# EAGLE schematic function_generator (EAGLE 6.1)
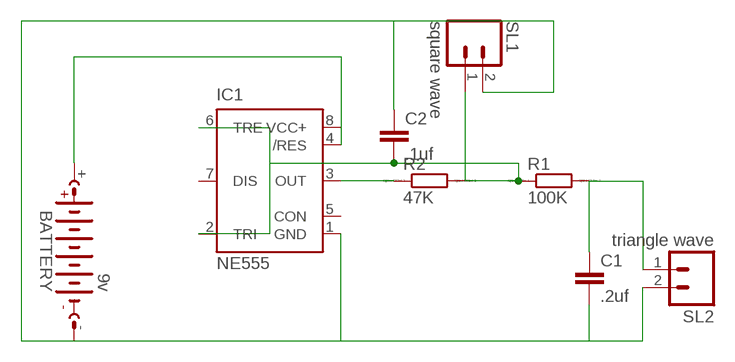
[diagram p0: schematic, sheet 1]

## Parts
BATTERY  9v  AB9V  [AB9V]
C1  .2uf  C2,5-3  [C2.5-3]
C2  .1uf  C2,5-3  [C2.5-3]
IC1  NE555  [DIL-08]
R1  100K  R0204/7  [0204/7]
R2  47K  R0204/7  [0204/7]
SL1  square wave  M02  [02P]
SL2  triangle wave  M02  [02P]

## Nets
N$1: BATTERY.+ IC1.4(/RES) IC1.8(VCC+)
N$2: C2.2 IC1.2(TRI) IC1.6(TRE) R1.1 R2.2 SL1.1
N$4: BATTERY.- C1.2 C2.1 IC1.1(GND) SL1.2 SL2.2
N$5: IC1.3(OUT) R2.1
N$6: C1.1 R1.2 SL2.1
Unconnected: IC1.5(CON) IC1.7(DIS)

## Library data of the parts
BATTERY = battery:AB9V: 9-V BATTERY CLIP
C1 C2 = capacitor-wima:C: CAPACITOR naming: grid - package width
IC1 = st-microelectronics:NE555: General purpose bipolar Timer; MF: Arrow Electronics; MPN: NE555N; OC_FARNELL: 1467742; OC_NEWARK: 89K1486
R1 R2 = eagle-ltspice:R: RESISTOR, European symbol; SPICEMODEL: NONE; SPICEPREFIX: R
SL1 SL2 = con-amp-quick:M02: AMP QUICK CONNECTOR; OC_FARNELL: unknown; OC_NEWARK: unknown